# Altium project tx_mini.PrjPcb
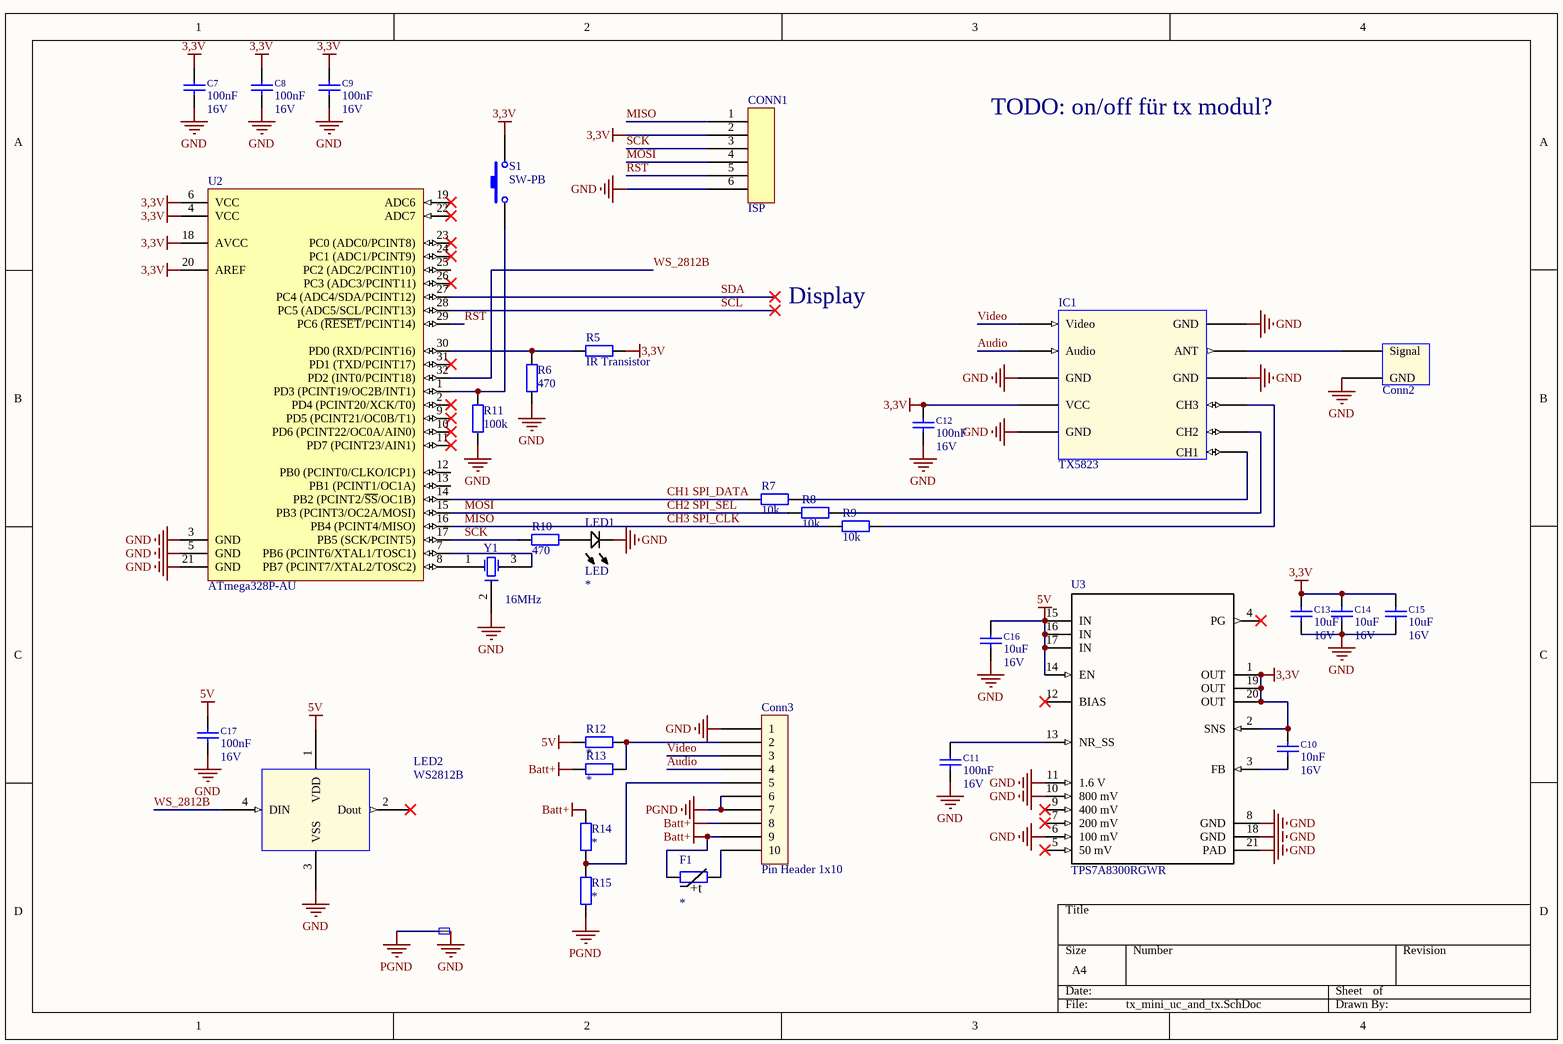
[diagram p0: tx_mini_uc_and_tx.SchDoc]
2 sheets, 46 parts. Net scope: global (net labels, ports and power ports of the same name join across sheets).
Board file: tx_mini.PcbDoc
Sheets:
  tx_mini_uc_and_tx.SchDoc
  tx_mini_buck.SchDoc

## Sheet tx_mini_uc_and_tx.SchDoc
size A4

### Parts
1  Net Tie  [Net Tie 0201]  (value not drawn)  (net tie, no BOM)
C7  Voltage: 16V  [C0402]  (hidden comment: 100nF)
C8  Voltage: 16V  [C0402]  (hidden comment: 100nF)
C9  Voltage: 16V  [C0402]  (hidden comment: 100nF)
C10  Voltage: 16V  [C0402]  (hidden comment: 10nF)
C11  Voltage: 16V  [C0402]  (hidden comment: 100nF)
C12  Voltage: 16V  [C0402]  (hidden comment: 100nF)
C13  Voltage: 16V  [C0805]  (hidden comment: 10uF)
C14  Voltage: 16V  [C0805]  (hidden comment: 10uF)
C15  Voltage: 16V  [C0805]  (hidden comment: 10uF)
C16  Voltage: 16V  [C0805]  (hidden comment: 10uF)
C17  Voltage: 16V  [C0402]  (hidden comment: 100nF)
CONN1  ISP  [MICRO-MATCH SMD FTE 6]
Conn2  SMA  [SMA Straight]  (value not drawn)
Conn3  Pin Header 1x10  [Pin Header 1x10]
F1  PTC  [PTC 1812 (4532 metric)]  (value not drawn)
IC1  TX5823  [Tx5823]
LED1  LED  [LED-0603-GREEN]
LED2  WS2812B  [WS2812B]
R5  value IR Transistor  [RES1206]  (hidden comment: R)
R6  value 470  [RES0603]  (hidden comment: R)
R7  value 10k  [RES0603]  (hidden comment: R)
R8  value 10k  [RES0603]  (hidden comment: R)
R9  value 10k  [RES0603]  (hidden comment: R)
R10  value 470  [RES0603]  (hidden comment: R)
R11  value 100k  [RES0603]  (hidden comment: R)
R12  R  [RES0603]  (value not drawn)
R13  R  [RES0603]  (value not drawn)
R14  R  [RES0603]  (value not drawn)
R15  R  [RES0603]  (value not drawn)
S1  SW-PB  [pushbutton micro switch]
U2  ATmega328P-AU  [32A_N]
U3  TPS7A8300RGWR  [RGW20_N]
Y1  frequency: 16MHz  [CSTCE]  (hidden comment: Ceramic Resonators CSTCE)

### Nets
3,3V: C7.1 C8.1 C9.1 C10.1 C12.1 C13.1 C14.1 C15.1 CONN1.2 IC1.4(VCC) R5.2 S1.2 U2.4(VCC) U2.6(VCC) U2.18(AVCC) U2.20(AREF) U3.1(OUT) U3.2(SNS) U3.19(OUT) U3.20(OUT)
5V: C16.1 C17.1 LED2.1(VDD) R12.1 U3.14(EN) U3.15(IN) U3.16(IN) U3.17(IN)
Batt+: Conn3.8 Conn3.9 F1.1 R13.1 R14.2
GND: 1.2 C7.2 C8.2 C9.2 C11.2 C12.2 C13.2 C14.2 C15.2 C16.2 C17.2 CONN1.6 Conn2.1(GND) Conn3.1 IC1.3(GND) IC1.5(GND) IC1.9(GND) IC1.11(GND) LED1.K LED2.3(VSS) R6.1 R11.1 U2.3(GND) U2.5(GND) U2.21(GND) U3.6(100_mV) U3.8(GND) U3.10(800_mV) U3.11(1.6_V) U3.18(GND) U3.21(PAD) Y1.2
PGND: 1.1 Conn3.6 Conn3.7 R15.1
Audio: Conn3.4 IC1.2(Audio)
CH1 SPI_DATA: R7.1 U2.14(PB2_(PCINT2/~{SS}/OC1B))
CH2 SPI_SEL: CONN1.4 R8.1 U2.15(PB3_(PCINT3/OC2A/MOSI))  [also labelled MOSI]
CH3 SPI_CLK: CONN1.1 R9.1 U2.16(PB4_(PCINT4/MISO))  [also labelled MISO]
RST: CONN1.5 U2.29(PC6_(~{RESET}/PCINT14))
SCK: CONN1.3 R10.1 U2.17(PB5_(SCK/PCINT5))
SCL: U2.28(PC5_(ADC5/SCL/PCINT13))
SDA: U2.27(PC4_(ADC4/SDA/PCINT12))
Video: Conn3.3 IC1.1(Video)
WS_2812B: LED2.4(DIN) U2.32(PD2_(INT0/PCINT18))
NetC10_2: C10.2 U3.3(FB)
NetC11_1: C11.1 U3.13(NR_SS)
NetConn2_2: Conn2.2(Signal) IC1.10(ANT)
NetConn3_2: Conn3.2 R12.2 R13.2
NetConn3_5: Conn3.5 R14.1 R15.2
NetConn3_10: Conn3.10 F1.2
NetIC1_6: IC1.6(CH1) R7.2
NetIC1_7: IC1.7(CH2) R8.2
NetIC1_8: IC1.8(CH3) R9.2
NetLED1_A: LED1.A R10.2
NetR5_1: R5.1 R6.2 U2.30(PD0_(RXD/PCINT16))
NetR11_2: R11.2 S1.1 U2.1(PD3_(PCINT19/OC2B/INT1))
NetU2_7: U2.7(PB6_(PCINT6/XTAL1/TOSC1)) Y1.3
NetU2_8: U2.8(PB7_(PCINT7/XTAL2/TOSC2)) Y1.1

Not connected (* = marked no-connect by the designer): LED2 2(Dout)*; U2 2(PD4_(PCINT20/XCK/T0))* 9(PD5_(PCINT21/OC0B/T1))* 10(PD6_(PCINT22/OC0A/AIN0))* 11(PD7_(PCINT23/AIN1))* 12(PB0_(PCINT0/CLKO/ICP1)) 13(PB1_(PCINT1/OC1A)) 19(ADC6)* 22(ADC7)* 23(PC0_(ADC0/PCINT8))* 24(PC1_(ADC1/PCINT9))* 25(PC2_(ADC2/PCINT10)) 26(PC3_(ADC3/PCINT11))* 31(PD1_(TXD/PCINT17))*; U3 4(PG)* 5(50_mV)* 7(200_mV)* 9(400_mV)* 12(BIAS)*

### Notes on the sheet
- TODO: on/off für tx modul?
- Display
- (in symbol PTC) +t

### Library data of the parts
C7-C9 C11 C12 C17 = C 100nF 0402: Capacitor; Best.Nr.:: *; Herst.Bez.:: *; Distributor: *; Value: 100nF
C10 C13-C16 = C: Capacitor; Best.Nr.:: *; Herst.Bez.:: *; Distributor: *
  C10: Value: 10nF
  C13-C16: Value: 10uF
CONN1 = Micromatch 02x03 SMD: Micromatch; Herstellernummer: 188275-6
LED2 = WS2812B: RGB LED with serial in and out
R5 = R: Resistor; Herst.Bez.:: PT15-21B/TR8; Best.Nr.:: *; Datenblatt: *; Distributor: *; Bezeichnung: *
R6-R15 = R: Resistor; Best.Nr.:: *; Herst.Bez.:: *; Datenblatt: *; Distributor: *; Bezeichnung: *
  R12-R15: Value: *
S1 = SW-PB: Switch; Published: 24-Mar-1999; LatestRevisionDate: 17-Jul-2002; LatestRevisionNote: Re-released for DXP Platform.; PackageReference: SPST-2; Publisher: Altium Limited; PackageDescription: Switch; 2 Leads
U2 = ATmega328P-AU: 8-bit AVR Microcontroller, 32KB Flash, 1KB EEPROM, 2KB SRAM, 32-pin TQFP, Industrial Grade (-40°C to 85°C); Published: 1-Apr-2010; DatasheetVersion: revA, Jan-2010; PackageVersion: revB, Oct-2001; PackageReference: 32A; Publisher: Altium Limited; PackageDescription: 32-Lead, 7x7x1.0 mm Body, 0.8mm Lead Pitch, Thin Profile Plastic Quad Flat Package (TQFP); Supplier 1: Digi-Key; Supplier Part Number 1: ATMEGA328P-AU-ND; Supplier 2: Farnell; Supplier Part Number 2: 1715486; Supplier 3: Mouser; Supplier Part Number 3: 556-ATMEGA328P-AU; Code_JEDEC: MS-026-ABA; ComponentLink1Description: Manufacturer Link; ComponentLink1URL: http://www.atmel.com/products/avr/default.asp?; ComponentLink2Description: ATmega48A/48PA/88A/88PA/168A/168PA/328/328P Datasheet; ComponentLink2URL: http://www.atmel.com/dyn/resources/prod_documents/8271.pdf; ComponentLink3Description: ATmega48A/48PA/88A/88PA/168A/168PA/328/328P Summary; ComponentLink3URL: http://www.atmel.com/dyn/resources/prod_documents/8271S.pdf; ComponentLink4Description: Atmel.com Home; ComponentLink4URL: http://www.atmel.com
U3 = TPS7A8300RGWR: Imported; Manufacturer: Texas Instruments; CompType: IC; PIN_COUNT: 21; PartNumber: TPS7A8300RGW; PackageReference: RGW0020A; MountType: SMT; RoHS: Y; RefDes: RefDes; Type: DEV; Value: Value
F1 = PTC: Best.Nr.:: *; Herst.Bez.:: *; Datenblatt: *; Distributor: *; Bezeichnung: *; Value: *
LED1 = LED: colour: *

## Sheet tx_mini_buck.SchDoc
size A4
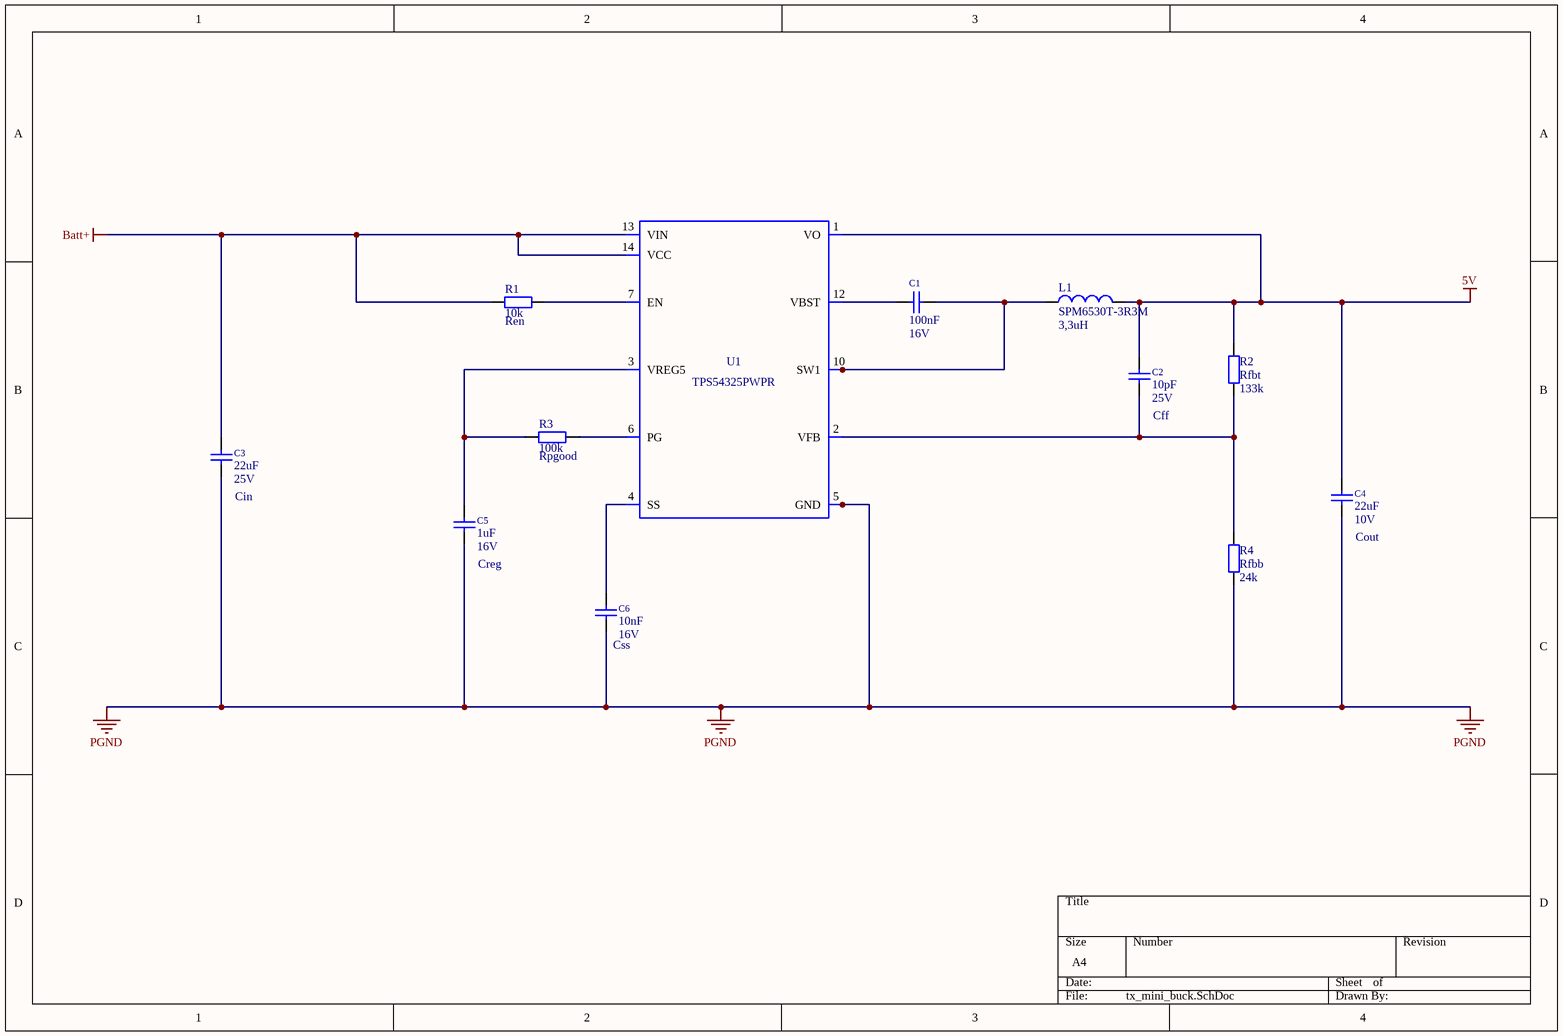
[diagram p1: tx_mini_buck.SchDoc]

### Parts
C1  Voltage: 16V  [C0402]  (hidden comment: 100nF)
C2  Voltage: 25V  Bezeichnung: Cff  [C0402]  (hidden comment: 10pF)
C3  Voltage: 25V  Bezeichnung: Cin  [C1210]  (hidden comment: 22uF)
C4  Voltage: 10V  Bezeichnung: Cout  [C1206]  (hidden comment: 22uF)
C5  Voltage: 16V  Bezeichnung: Creg  [C0603]  (hidden comment: 1uF)
C6  Voltage: 16V  Bezeichnung: Css  [C0402]  (hidden comment: 10nF)
L1  Herst.Bez.:: SPM6530T-3R3M  Inductance: 3,3uH  [SPM6530]  (hidden comment: Inductance)
R1  value 10k  Bezeichnung: Ren  [RES0402]  (hidden comment: R)
R2  value 133k  Bezeichnung: Rfbt  [RES0402]  (hidden comment: R)
R3  value 100k  Bezeichnung: Rpgood  [RES0402]  (hidden comment: R)
R4  value 24k  Bezeichnung: Rfbb  [RES0603]  (hidden comment: R)
U1  TPS54225PWP  [R-PDSO-G14]  (value not drawn)

### Nets
5V: C2.1 C4.1 L1.2 R2.2 U1.1(VO)
Batt+: C3.1 R1.1 U1.13(VIN) U1.14(VCC)
PGND: C3.2 C4.2 C5.2 C6.2 R4.1 U1.5(GND) U1.8(PGND1) U1.9(PGND2) U1.15(ETPAD)
NetC1_1: C1.1 U1.12(VBST)
NetC1_2: C1.2 L1.1 U1.10(SW1) U1.11(SW2)
NetC2_2: C2.2 R2.1 R4.2 U1.2(VFB)
NetC5_1: C5.1 R3.1 U1.3(VREG5)
NetC6_1: C6.1 U1.4(SS)
NetR1_2: R1.2 U1.7(EN)
NetR3_2: R3.2 U1.6(PG)

### Library data of the parts
C1 = C 100nF 0402: Capacitor; Best.Nr.:: *; Herst.Bez.:: *; Distributor: *; Value: 100nF
C2 = C: Capacitor; Herst.Bez.:: GRM1555C1E100JA01D; Best.Nr.:: *; Distributor: *; Value: 10pF
C3 = C: Capacitor; Herst.Bez.:: GRM32ER61E226KE15L; Best.Nr.:: *; Distributor: *; Value: 22uF
C4-C6 = C: Capacitor; Best.Nr.:: *; Herst.Bez.:: *; Distributor: *
  C4: Value: 22uF
  C5: Value: 1uF
  C6: Value: 10nF
L1 = L power: Power Inductance; Vendor: *; Best.Nr.:: *; Datenblatt: *; Distributor: *; Bezeichnung: *; Mounted: *
R1 R3 = R: Resistor; Best.Nr.:: *; Datenblatt: *; Distributor: *
R2 = R: Resistor; Herst.Bez.:: CRCW0402133KFKED; Best.Nr.:: *; Datenblatt: *; Distributor: *
R4 = R: Resistor; Herst.Bez.:: RC0603FR-0724KL; Best.Nr.:: *; Datenblatt: *; Distributor: *
U1 = TPS54225PWP: TPS54325PWPR; Manufacturer Name: Texas Instruments; Value: UNLISTED; PackageReference: TPS54325PWPR; Manufacturer Part Number: TPS54225PWP

## Nets that join several sheets
5V: tx_mini_uc_and_tx (8 pins), tx_mini_buck (5 pins)
Batt+: tx_mini_uc_and_tx (5 pins), tx_mini_buck (C3.1 R1.1 U1.13 U1.14)
PGND: tx_mini_uc_and_tx (1.1 Conn3.6 Conn3.7 R15.1), tx_mini_buck (9 pins)